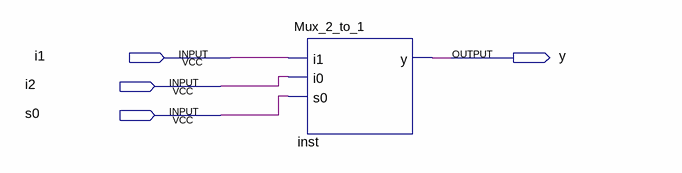
[diagram p0: schematic sheet]
// Quartus schematic Mux-2-to-1.bdf as structural Verilog: 1 symbols, 4 pins
module \Mux-2-to-1  (
  input  i1,
  input  i2,
  input  s0,
  output y
);

  Mux_2_to_1 inst (.i1(i1), .i0(i2), .s0(s0), .y(y));
endmodule
